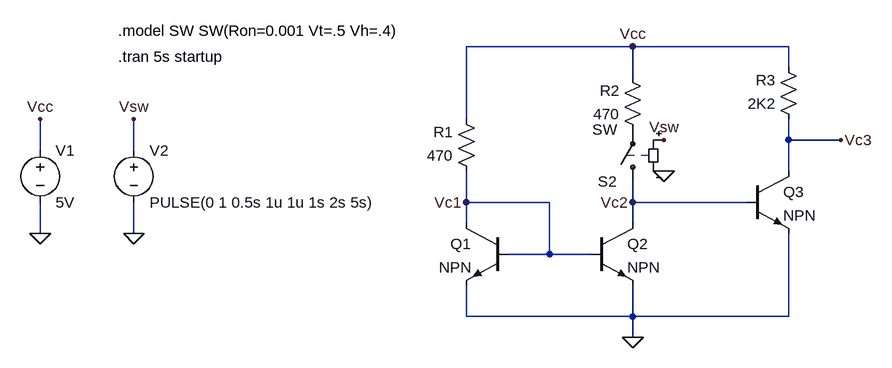
[diagram p0: schematic board-f3-1.asc]
board-f3-1.asc, the LTspice schematic file:
Version 4
SHEET 1 880 680
WIRE 96 -160 -160 -160
WIRE 336 -160 96 -160
WIRE 336 -128 336 -160
WIRE 96 -112 96 -160
WIRE -160 -48 -160 -160
WIRE 336 -16 336 -48
WIRE 416 -16 336 -16
WIRE -816 0 -816 -48
WIRE -672 0 -672 -48
WIRE 336 32 336 -16
WIRE -160 80 -160 32
WIRE -32 80 -160 80
WIRE 96 80 96 48
WIRE 272 80 96 80
WIRE -160 112 -160 80
WIRE 96 112 96 80
WIRE -816 128 -816 80
WIRE -672 128 -672 80
WIRE -32 160 -32 80
WIRE -32 160 -96 160
WIRE 32 160 -32 160
WIRE -160 256 -160 208
WIRE 96 256 96 208
WIRE 96 256 -160 256
WIRE 336 256 336 128
WIRE 336 256 96 256
WIRE 96 288 96 256
FLAG 96 -160 Vcc
FLAG 416 -16 Vc3
FLAG -816 128 0
FLAG -816 -48 Vcc
FLAG 96 288 0
FLAG -672 128 0
FLAG -672 -48 Vsw
FLAG 96 80 Vc2
FLAG -160 80 Vc1
FLAG 144 32 0
FLAG 144 -16 Vsw
SYMBOL npn 272 32 R0
SYMATTR InstName Q3
SYMBOL res 352 -32 R180
WINDOW 0 36 76 Left 2
WINDOW 3 36 40 Left 2
SYMATTR InstName R3
SYMATTR Value 2K2
SYMBOL npn 32 112 R0
SYMATTR InstName Q2
SYMBOL voltage -816 -16 R0
WINDOW 123 0 0 Left 0
WINDOW 39 0 0 Left 0
SYMATTR InstName V1
SYMATTR Value 5V
SYMBOL res -144 48 R180
WINDOW 0 36 76 Left 2
WINDOW 3 36 40 Left 2
SYMATTR InstName R1
SYMATTR Value 470
SYMBOL npn -96 112 M0
SYMATTR InstName Q1
SYMBOL res 112 -16 R180
WINDOW 0 36 76 Left 2
WINDOW 3 36 40 Left 2
SYMATTR InstName R2
SYMATTR Value 470
SYMBOL voltage -672 -16 R0
WINDOW 123 0 0 Left 0
WINDOW 39 0 0 Left 0
SYMATTR InstName V2
SYMATTR Value PULSE(0 1 0.5s 1u 1u 1s 2s 5s)
SYMBOL sw 96 64 R180
SYMATTR InstName S2
TEXT -696 -144 Left 2 !.tran 5s startup
TEXT -696 -184 Left 2 !.model SW SW(Ron=0.001 Vt=.5 Vh=.4)

The netlist it stands for:
* board-f3-1.asc
Q3 Vc3 Vc2 0 0 NPN
R3 Vc3 Vcc 2K2
Q2 Vc2 Vc1 0 0 NPN
V1 Vcc 0 5V
R1 Vc1 Vcc 470
Q1 Vc1 Vc1 0 0 NPN
R2 P001 Vcc 470
V2 Vsw 0 PULSE(0 1 0.5s 1u 1u 1s 2s 5s)
S2 Vc2 P001 Vsw 0 SW
.model NPN NPN
.model PNP PNP
.lib standard.bjt
.tran 5s startup
.model SW SW(Ron=0.001 Vt=.5 Vh=.4)
.backanno
.end